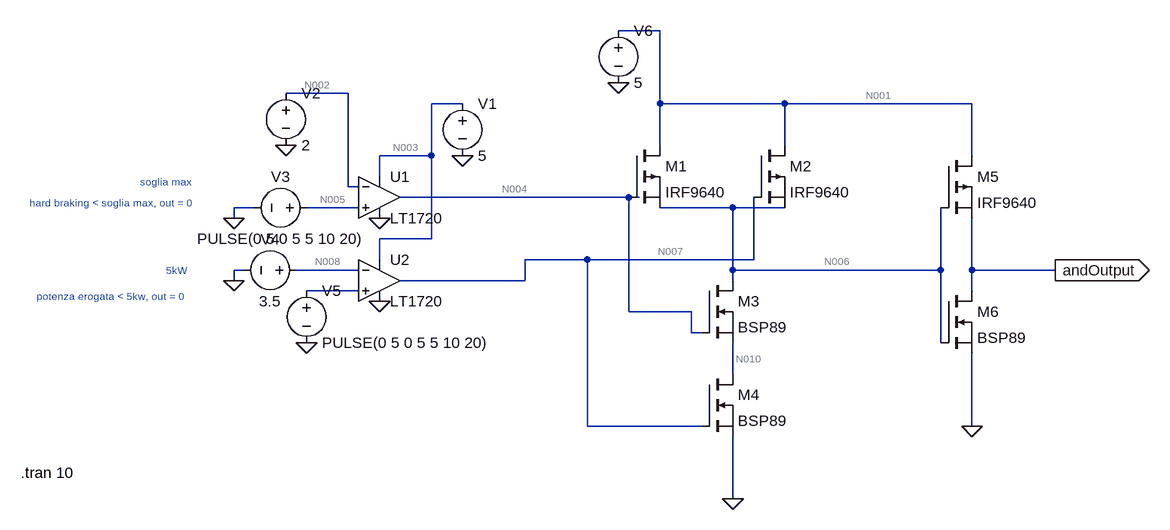
[diagram p0: schematic Draft1.asc]
Draft1.asc, the LTspice schematic file:
Version 4
SHEET 1 968 680
WIRE 176 -240 112 -240
WIRE -304 -144 -400 -144
WIRE -128 -128 -176 -128
WIRE 176 -128 176 -240
WIRE 368 -128 176 -128
WIRE 656 -128 368 -128
WIRE 176 -64 176 -128
WIRE 368 -64 368 -128
WIRE -176 -48 -176 -128
WIRE -176 -48 -256 -48
WIRE 656 -48 656 -128
WIRE -256 -16 -256 -48
WIRE -304 0 -304 -144
WIRE -288 0 -304 0
WIRE 128 16 -224 16
WIRE 144 16 128 16
WIRE -448 32 -480 32
WIRE -288 32 -368 32
WIRE 288 32 176 32
WIRE 368 32 288 32
WIRE -480 48 -480 32
WIRE -176 80 -176 -48
WIRE -176 80 -256 80
WIRE -256 112 -256 80
WIRE 64 112 -32 112
WIRE 320 112 320 16
WIRE 320 112 64 112
WIRE -464 128 -480 128
WIRE -288 128 -384 128
WIRE 288 128 288 32
WIRE 608 128 608 32
WIRE 608 128 288 128
WIRE 656 128 656 48
WIRE 784 128 656 128
WIRE -480 144 -480 128
WIRE -32 144 -32 112
WIRE -32 144 -224 144
WIRE 288 144 288 128
WIRE -288 160 -368 160
WIRE 656 160 656 128
WIRE 128 192 128 16
WIRE 224 192 128 192
WIRE 224 224 224 192
WIRE 240 224 224 224
WIRE 608 240 608 128
WIRE 288 288 288 240
WIRE 64 368 64 112
WIRE 240 368 64 368
WIRE 656 368 656 256
WIRE 288 480 288 384
FLAG -256 48 0
FLAG -256 176 0
FLAG -128 -48 0
FLAG -480 48 0
FLAG -480 144 0
FLAG -400 -64 0
FLAG -368 240 0
FLAG 112 -160 0
FLAG 656 368 0
FLAG 784 128 andOutput
IOPIN 784 128 Out
FLAG 288 480 0
SYMBOL voltage -128 -144 R0
WINDOW 123 0 0 Left 0
WINDOW 39 0 0 Left 0
SYMATTR InstName V1
SYMATTR Value 5
SYMBOL Comparators\\LT1720 -256 -48 R0
SYMATTR InstName U1
SYMBOL Comparators\\LT1720 -256 80 R0
SYMATTR InstName U2
SYMBOL voltage -400 -160 R0
WINDOW 123 0 0 Left 0
WINDOW 39 0 0 Left 0
SYMATTR InstName V2
SYMATTR Value 2
SYMBOL voltage -352 32 R90
WINDOW 0 -32 56 VBottom 2
WINDOW 3 32 56 VTop 2
WINDOW 123 0 0 Left 0
WINDOW 39 0 0 Left 0
SYMATTR InstName V3
SYMATTR Value PULSE(0 5 0 5 5 10 20)
SYMBOL voltage -368 128 R90
WINDOW 0 -32 56 VBottom 2
WINDOW 3 32 56 VTop 2
WINDOW 123 0 0 Left 0
WINDOW 39 0 0 Left 0
SYMATTR InstName V4
SYMATTR Value 3.5
SYMBOL voltage -368 144 R0
WINDOW 123 0 0 Left 0
WINDOW 39 0 0 Left 0
SYMATTR InstName V5
SYMATTR Value PULSE(0 5 0 5 5 10 20)
SYMBOL pmos 128 -64 R0
SYMATTR InstName M1
SYMATTR Value IRF9640
SYMBOL pmos 320 -64 R0
SYMATTR InstName M2
SYMATTR Value IRF9640
SYMBOL nmos 240 144 R0
SYMATTR InstName M3
SYMATTR Value BSP89
SYMBOL nmos 240 288 R0
SYMATTR InstName M4
SYMATTR Value BSP89
SYMBOL voltage 112 -256 R0
WINDOW 123 0 0 Left 0
WINDOW 39 0 0 Left 0
SYMATTR InstName V6
SYMATTR Value 5
SYMBOL pmos 608 -48 R0
SYMATTR InstName M5
SYMATTR Value IRF9640
SYMBOL nmos 608 160 R0
SYMATTR InstName M6
SYMATTR Value BSP89
TEXT -672 24 Center 1 ;hard braking < soglia max, out = 0
TEXT -672 168 Center 1 ;potenza erogata < 5kw, out = 0
TEXT -624 -8 Left 1 ;soglia max
TEXT -584 128 Left 1 ;5kW
TEXT -808 440 Left 2 !.tran 10

The netlist it stands for:
* Draft1.asc
V1 N003 0 5
XU1 N005 N002 N003 0 N004 LT1720  ; pins In+ In- V+ V- OUT
XU2 N009 N008 N003 0 N007 LT1720  ; pins In+ In- V+ V- OUT
V2 N002 0 2
V3 N005 0 PULSE(0 5 0 5 5 10 20)
V4 N008 0 3.5
V5 N009 0 PULSE(0 5 0 5 5 10 20)
M1 N001 N004 N006 N006 IRF9640
M2 N001 N007 N006 N006 IRF9640
M3 N006 N004 N010 N010 BSP89
M4 N010 N007 0 0 BSP89
V6 N001 0 5
M5 N001 N006 andOutput andOutput IRF9640
M6 andOutput N006 0 0 BSP89
.model NMOS NMOS
.model PMOS PMOS
.lib standard.mos
* hard braking < soglia max, out = 0
* potenza erogata < 5kw, out = 0
* soglia max
* 5kW
.tran 10
.lib LT1720.sub
.backanno
.end

* Results of the author's LTspice run, read from the files saved beside the schematic
* Operating Point, zero values left out:
*   V(n003) = 5 V
*   V(n002) = 2 V
*   V(n004) = 171.5 mV
*   V(n008) = 3.5 V
*   V(n007) = 171.5 mV
*   V(n001) = 5 V
*   V(n006) = 5 V
*   V(n010) = 2.5 V
*   V(andoutput) = 4.241 V
*   Id(M1) = 2.794 pA
*   Is(M1) = -2.794 pA
*   Id(M2) = 2.794 pA
*   Is(M2) = -2.794 pA
*   Id(M5) = 935.1 mA
*   Is(M5) = -935.1 mA
*   Id(M3) = 3.1 pA
*   Is(M3) = -3.1 pA
*   Id(M4) = 3.1 pA
*   Is(M4) = -3.1 pA
*   Id(M6) = 935.1 mA
*   Is(M6) = -935.1 mA
*   I(V1) = -8.001 mA
*   I(V2) = 100 pA
*   I(V3) = 5 µA
*   I(V4) = 100 pA
*   I(V5) = 5 µA
*   I(V6) = -935.1 mA
*   Ix(u1:1) = -5 µA
*   Ix(u1:2) = -100 pA
*   Ix(u1:3) = 4 mA
*   Ix(u1:4) = -3.995 mA
*   Ix(u1:5) = 4.647 pA
*   Ix(u2:1) = -5 µA
*   Ix(u2:2) = -100 pA
*   Ix(u2:3) = 4 mA
*   Ix(u2:4) = -3.995 mA
*   Ix(u2:5) = 4.647 pA
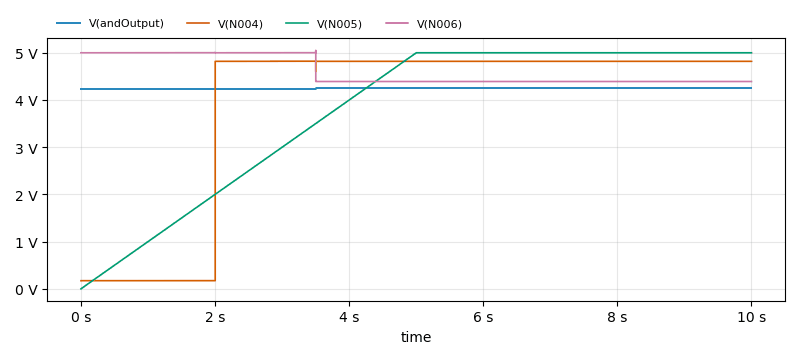
[diagram p1: Transient Analysis of Draft1.asc, plotted from the saved traces]
* Transient Analysis, 1 run:
*   V(andOutput): min 4.24 V, max 4.256 V, average 4.251 V, rms 4.251 V, last 4.256 V
*   V(N004): min 171.5 mV, max 4.838 V, average 3.888 V, rms 4.31 V, last 4.819 V
*   V(N005): min 0 V, max 5 V, average 3.75 V, rms 4.1 V, last 5 V
*   V(N006): min 4.391 V, max 5.051 V, average 4.604 V, rms 4.614 V, last 4.391 V